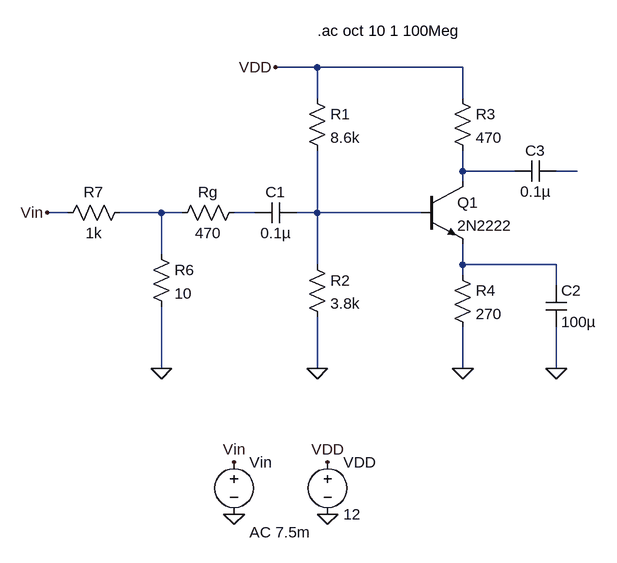
[diagram p0: schematic ce_high_frequency.asc]
ce_high_frequency.asc, the LTspice schematic file:
Version 4.1
SHEET 1 956 680
WIRE 336 -176 272 -176
WIRE 560 -176 336 -176
WIRE 336 -128 336 -176
WIRE 560 -128 560 -176
WIRE 560 -16 560 -48
WIRE 640 -16 560 -16
WIRE 736 -16 704 -16
WIRE 560 0 560 -16
WIRE -48 48 -80 48
WIRE 96 48 32 48
WIRE 128 48 96 48
WIRE 240 48 208 48
WIRE 336 48 336 -48
WIRE 336 48 304 48
WIRE 496 48 336 48
WIRE 96 112 96 48
WIRE 336 128 336 48
WIRE 560 128 560 96
WIRE 704 128 560 128
WIRE 560 144 560 128
WIRE 704 160 704 128
WIRE 96 288 96 192
WIRE 336 288 336 208
WIRE 560 288 560 224
WIRE 704 288 704 224
FLAG 208 512 0
FLAG 352 512 0
FLAG 208 432 Vin
FLAG 352 432 VDD
FLAG 272 -176 VDD
FLAG -80 48 Vin
FLAG 96 288 0
FLAG 336 288 0
FLAG 704 288 0
FLAG 560 288 0
SYMBOL res 320 112 R0
SYMATTR InstName R2
SYMATTR Value 3.8k
SYMBOL res 544 -144 R0
SYMATTR InstName R3
SYMATTR Value 470
SYMBOL res 544 128 R0
SYMATTR InstName R4
SYMATTR Value 270
SYMBOL res 320 -144 R0
SYMATTR InstName R1
SYMATTR Value 8.6k
SYMBOL res 224 32 R90
WINDOW 0 0 56 VBottom 2
WINDOW 3 32 56 VTop 2
SYMATTR InstName Rg
SYMATTR Value 470
SYMBOL cap 304 32 R90
WINDOW 0 0 32 VBottom 2
WINDOW 3 32 32 VTop 2
SYMATTR InstName C1
SYMATTR Value 0.1µ
SYMBOL npn 496 0 R0
SYMATTR InstName Q1
SYMATTR Value 2N2222
SYMBOL cap 688 160 R0
SYMATTR InstName C2
SYMATTR Value 100µ
SYMBOL voltage 208 416 R0
WINDOW 123 24 124 Left 2
WINDOW 39 0 0 Left 0
SYMATTR Value2 AC 7.5m
SYMATTR InstName Vin
SYMATTR Value ""
SYMBOL cap 704 -32 R90
WINDOW 0 0 32 VBottom 2
WINDOW 3 32 32 VTop 2
SYMATTR InstName C3
SYMATTR Value 0.1µ
SYMBOL voltage 352 416 R0
WINDOW 123 0 0 Left 0
WINDOW 39 0 0 Left 0
SYMATTR InstName VDD
SYMATTR Value 12
SYMBOL res 80 96 R0
SYMATTR InstName R6
SYMATTR Value 10
SYMBOL res 48 32 R90
WINDOW 0 0 56 VBottom 2
WINDOW 3 32 56 VTop 2
SYMATTR InstName R7
SYMATTR Value 1k
TEXT 336 -232 Left 2 !.ac oct 10 1 100Meg

The netlist it stands for:
* ce_high_frequency.asc
R2 N005 0 3.8k
R3 VDD N001 470
R4 N006 0 270
R1 VDD N005 8.6k
Rg N004 N003 470
C1 N005 N004 0.1µ
Q1 N001 N005 N006 0 2N2222
C2 N006 0 100µ
Vin Vin 0 AC 7.5m
C3 N002 N001 0.1µ
VDD VDD 0 12
R6 N003 0 10
R7 N003 Vin 1k
.model NPN NPN
.model PNP PNP
.lib standard.bjt
.ac oct 10 1 100Meg
.backanno
.end